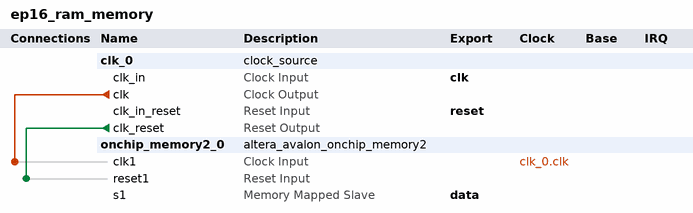
[diagram p0: system contents]
# Platform Designer (Qsys) system ep16_ram_memory, Cyclone IV E EP4CE6E22C8
# Parameters at their usual value, and those the tool derives, are not listed.
package require -exact qsys 18.1
create_system ep16_ram_memory
set_project_property DEVICE_FAMILY {Cyclone IV E}
set_project_property DEVICE EP4CE6E22C8

add_instance clk_0 clock_source 18.1
set_instance_parameter_value clk_0 clockFrequency 50000000

add_instance onchip_memory2_0 altera_avalon_onchip_memory2 18.1
set_instance_parameter_value onchip_memory2_0 dataWidth 16
set_instance_parameter_value onchip_memory2_0 dualPort false
set_instance_parameter_value onchip_memory2_0 initMemContent true
set_instance_parameter_value onchip_memory2_0 initializationFileName C:/Users/Demom/Documents/eP16/mem.mif
set_instance_parameter_value onchip_memory2_0 memorySize 4096
set_instance_parameter_value onchip_memory2_0 useNonDefaultInitFile true

# connections
add_connection clk_0.clk onchip_memory2_0.clk1 clock
add_connection clk_0.clk_reset onchip_memory2_0.reset1 reset

# exported interfaces
add_interface clk clock sink
set_interface_property clk EXPORT_OF clk_0.clk_in
add_interface data avalon slave
set_interface_property data EXPORT_OF onchip_memory2_0.s1
add_interface reset reset sink
set_interface_property reset EXPORT_OF clk_0.clk_in_reset

set_interconnect_requirement {$system} qsys_mm.clockCrossingAdapter HANDSHAKE
set_interconnect_requirement {$system} qsys_mm.enableEccProtection FALSE
set_interconnect_requirement {$system} qsys_mm.insertDefaultSlave FALSE
set_interconnect_requirement {$system} qsys_mm.maxAdditionalLatency 1

save_system ep16_ram_memory.qsys
